# Altium project CanStepDriverPowerstep.PrjPcb
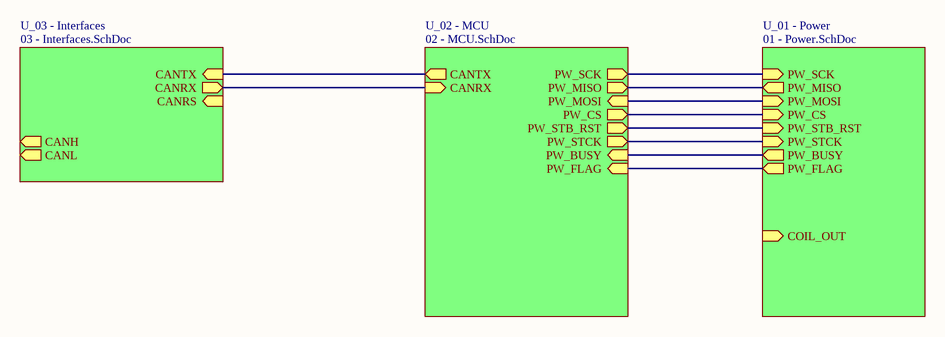
[diagram p0: 00 - Structure.SchDoc]
4 sheets, 45 parts. Net scope: hierarchical (ports join the sheet entries above them; power ports are global).
Board file: CanStepDriverPowerstep.PcbDoc
Sheets:
  00 - Structure.SchDoc
    U_01 - Power = 01 - Power.SchDoc
    U_02 - MCU = 02 - MCU.SchDoc
    U_03 - Interfaces = 03 - Interfaces.SchDoc

## Sheet 00 - Structure.SchDoc
size A4

### Sub-sheets
U_01 - Power = 01 - Power.SchDoc: COIL_OUT (in), PW_CS (in), PW_SCK (in), PW_MISO (out), PW_MOSI (in), PW_STB_RST (in), PW_BUSY (out), PW_FLAG (out), PW_STCK (in)
U_02 - MCU = 02 - MCU.SchDoc: CANTX (out), CANRX (in), PW_SCK (out), PW_MISO (out), PW_MOSI (in), PW_CS (out), PW_STB_RST (out), PW_STCK (out), PW_BUSY (in), PW_FLAG (in)
U_03 - Interfaces = 03 - Interfaces.SchDoc: CANH (out), CANL (out), CANTX (in), CANRX (out), CANRS (in)

### Nets
PA0: sheet U_01 - Power/PW_FLAG, sheet U_02 - MCU/PW_FLAG
PA1: sheet U_01 - Power/PW_BUSY, sheet U_02 - MCU/PW_BUSY
PA2: sheet U_01 - Power/PW_STCK, sheet U_02 - MCU/PW_STCK
PA3: sheet U_01 - Power/PW_STB_RST, sheet U_02 - MCU/PW_STB_RST
PA4: sheet U_01 - Power/PW_CS, sheet U_02 - MCU/PW_CS
PA5: sheet U_01 - Power/PW_SCK, sheet U_02 - MCU/PW_SCK
PA6: sheet U_01 - Power/PW_MISO, sheet U_02 - MCU/PW_MISO
PA7: sheet U_01 - Power/PW_MOSI, sheet U_02 - MCU/PW_MOSI
NetU4_33: sheet U_02 - MCU/CANRX, sheet U_03 - Interfaces/CANRX
NetU4_34: sheet U_02 - MCU/CANTX, sheet U_03 - Interfaces/CANTX

## Sheet 01 - Power.SchDoc
size A4; SheetNumber: 1; SheetTotal: 4
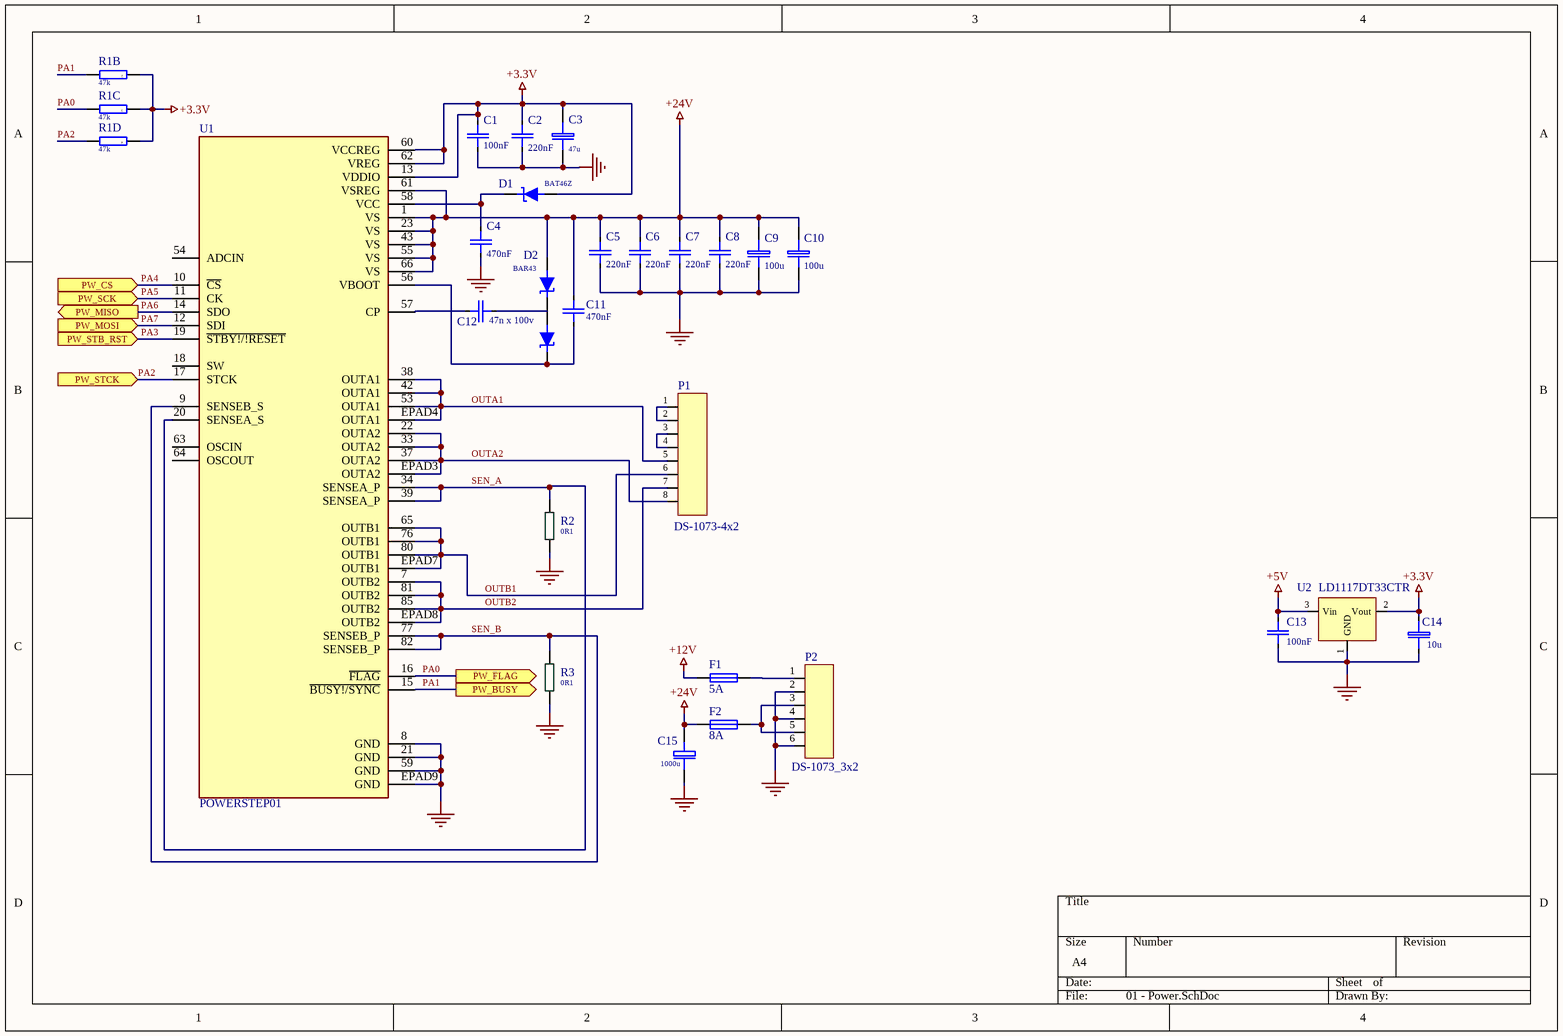
[diagram p1: 01 - Power.SchDoc]

### Parts
C1  100nF  [CAP: 0805]
C2  220nF  [CAP: 0805]
C3  47u  [EL SMD Case C D5x5.3 h5.4(0505)]
C4  470nF  [CAP: 0805]
C5  220nF  [CAP: 0805]
C6  220nF  [CAP: 0805]
C7  220nF  [CAP: 0805]
C8  220nF  [CAP: 0805]
C9  100u  [EL SMD Case G D10x10.3 h10.2(1010)]
C10  100u  [EL SMD Case G D10x10.3 h10.2(1010)]
C11  470nF  [CAP: 0805]
C12  value 47n x 100v  [CAP: 0805]
C13  100nF  [CAP: 0805]
C14  10u  [EL Case A (3216-18)]
C15  1000u  [El-d13-h21-F5.08]
D1  BAT46Z  [SOD123]
D2  BAR43  [SOT23]
F1  5A  [Littelfuse 0451/453]
F2  8A  [Littelfuse 0451/453]
P1  DS-1073-4x2  [DS-1073-4x2]
P2  DS-1073_3x2  [DS-1073-2x3]
R1  47k  [RM4x0603]  (parts B,C,D of 4)
R2  0R1  [R2512]
R3  0R1  [R2512]
U1  POWERSTEP01  [POWERSTEP01]
U2  LD1117DT33CTR  [DPAK]

### Ports
PW_BUSY (out), PW_CS (in), PW_FLAG (out), PW_MISO (out), PW_MOSI (in), PW_SCK (in), PW_STB_RST (in), PW_STCK (in)

### Nets
+3.3V: C1.2 C2.1 C3.1(+) C14.1 D1.1(A) R1.2 R1.3 R1.4 U1.13(VDDIO) U1.60(VCCREG) U1.62(VREG) U2.2(Vout)
+5V: C13.2 U2.3(Vin)
+12V: F1.1
+24V: C5.1 C6.1 C7.1 C8.1 C9.1 C10.1 C11.1 C15.1 D2.1 F2.1 U1.1(VS) U1.23(VS) U1.43(VS) U1.55(VS) U1.61(VSREG) U1.66(VS)
GND: C1.1 C2.2 C3.2(-) C4.2 C5.2 C6.2 C7.2 C8.2 C9.2 C10.2 C13.1 C14.2 C15.2 P2.2 P2.4 P2.6 R2.1 R3.1 U1.8(GND) U1.21(GND) U1.59(GND) U1.EPAD9(GND) U2.1(GND)
OUTA1: P1.5 U1.38(OUTA1) U1.42(OUTA1) U1.53(OUTA1) U1.EPAD4(OUTA1)
OUTA2: P1.8 U1.22(OUTA2) U1.33(OUTA2) U1.37(OUTA2) U1.EPAD3(OUTA2)
OUTB1: P1.6 U1.65(OUTB1) U1.76(OUTB1) U1.80(OUTB1) U1.EPAD7(OUTB1)
OUTB2: P1.7 U1.7(OUTB2) U1.81(OUTB2) U1.85(OUTB2) U1.EPAD8(OUTB2)
PA0: R1.6 U1.16(~{FLAG}) ; port PW_FLAG
PA1: R1.7 U1.15(~{BUSY!/SYNC}) ; port PW_BUSY
PA2: R1.5 U1.17(STCK) ; port PW_STCK
PA3: U1.19(~{STBY!/!RESET}) ; port PW_STB_RST
PA4: U1.10(~{CS}) ; port PW_CS
PA5: U1.11(CK) ; port PW_SCK
PA6: U1.14(SDO) ; port PW_MISO
PA7: U1.12(SDI) ; port PW_MOSI
SEN_A: R2.2 U1.20(SENSEA_S) U1.34(SENSEA_P) U1.39(SENSEA_P)
SEN_B: R3.2 U1.9(SENSEB_S) U1.77(SENSEB_P) U1.82(SENSEB_P)
NetC4_1: C4.1 D1.2(C) U1.58(VCC)
NetC11_2: C11.2 D2.2 U1.56(VBOOT)
NetC12_1: C12.1 U1.57(CP)
NetC12_2: C12.2 D2.3
NetF1_2: F1.2 P2.1
NetF2_2: F2.2 P2.3 P2.5
NetP1_1: P1.1 P1.2
NetP1_3: P1.3 P1.4

Not connected (* = marked no-connect by the designer): U1 18(SW) 54(ADCIN) 63(OSCIN) 64(OSCOUT)

### Library data of the parts
C1 C2 C4-C8 C11-C13 = C-0805: SMD-0805; Price: 0.014
  C1 C13: Value: 100nF
  C2 C5-C8: Value: 220nF; ComponentLink1Description: New link; ComponentLink1URL: https://www.electronshik.ru/item/YAG/CC0805KKX7R9BB224
  C4 C11: Value: 470nF; ComponentLink1Description: New link; ComponentLink1URL: https://www.electronshik.ru/item/MUR/GRM21BR71H474KA88L
  C12: ComponentLink1Description: New link; ComponentLink1URL: https://www.electronshik.ru/item/YAG/CC0805KKX7R0BB473
C3 = EL 10u/50V: EL 50V SMD Case C D5x5.3 h5.4; Price: 0.014; Value: 47u
C9 C10 = EL 100u/35V: EL 35V SMD Case G D10x10.3h10.5; Price: 0.014; Value: 100u; ComponentLink1Description: New link; ComponentLink1URL: https://www.chipdip.ru/product0/9000565738
C14 = EL 10u/16V Tant.: El Case A (2012-12); Price: 0.22; Value: 10u; ComponentLink1Description: New link; ComponentLink1URL: https://www.electronshik.ru/item/VISHAY/293D106X0016A2TE3; ComponentLink2Description: New link; ComponentLink2URL: https://www.chipdip.ru/product0/868717967
C15 = 1000u-35V 105F: 35V 105C 34m 1.8A 5000h; Price: 0.42; Value: 1000u
D1 = 1N6263: SMD-SOT123 60V 15mA 2.2pF 1nS; Price: 0.07; ComponentLink1Description: New link; ComponentLink1URL: https://www.electronshik.ru/item/ST/BAT46ZFILM
D2 = BAT54S: SMD-SOT23 30V 0.2A 5nS 10pF; Price: 0.08; ComponentLink1Description: New link; ComponentLink1URL: https://www.electronshik.ru/item/ST/BAR43FILM
F1 F2 = Littelfuse 0451: 0451003; Price: 0.3; ComponentLink1Description: New link; ComponentLink1URL: https://www.electronshik.ru/item/LTL/0451003.MRL
R1 = 4RM-0603: SMD 4RM-0603 1\16W 5%; Price: 0.07; Value: 47k; ComponentLink1Description: New link; ComponentLink1URL: https://www.electronshik.ru/item/BOURNS/CAT16-473J4LF
R2 R3 = R-2512: SMD 2512 1W 5% 200V; Price: 0.087; Value: 0R1; ComponentLink1Description: New link; ComponentLink1URL: https://www.electronshik.ru/item/BOURNS/CRA2512-FZ-R100ELF
U1 = POWERSTEP01: Bipolar Motor Driver Power MOSFET SPI 89-VFQFPN _11x14_; MF: STMicroelectronics; MP: POWERSTEP01; Availability: Unavailable; Package: PowerVFQFN-89 STMicroelectronics; Value: *; Price: None; ComponentLink1Description: Buy; ComponentLink1URL: https://www.electronshik.ru/item/ST/POWERSTEP01; ComponentLink2Description: Module; ComponentLink2URL: https://www.st.com/resource/en/user_manual/dm00206777-getting-started-with-the-high-power-stepper-motor-driver-expansion-board-based-on-powerstep01-for-stm32-nucleo-stmicroelectronics.pdf; ComponentLink3Description: Software; ComponentLink3URL: https://www.st.com/resource/en/user_manual/dm00207127-getting-started-with-the-xcubespn3-high-power-stepper-motor-driver-software-expansion-for-stm32cube-stmicroelectronics.pdf; ComponentLink4Description: Datasheet; ComponentLink4URL: https://www.st.com/resource/en/datasheet/powerstep01.pdf
P1 = DS-1073-4x2: ComponentLink1Description: New link; ComponentLink1URL: https://www.chipdip.ru/product/ds1073-01-2x4-mr2t6-mf2x4mra
P2 = DS-1073_3x2: ComponentLink1Description: New link; ComponentLink1URL: https://www.chipdip.ru/product/ds1073-01-2x3-mr2t6-mf2x3mra
U2 = LD1117DT33CTR: ComponentLink1Description: New link; ComponentLink1URL: https://www.chipdip.ru/product/ld1117dt33ctr

## Sheet 02 - MCU.SchDoc
size A4; SheetNumber: 2; SheetTotal: 4
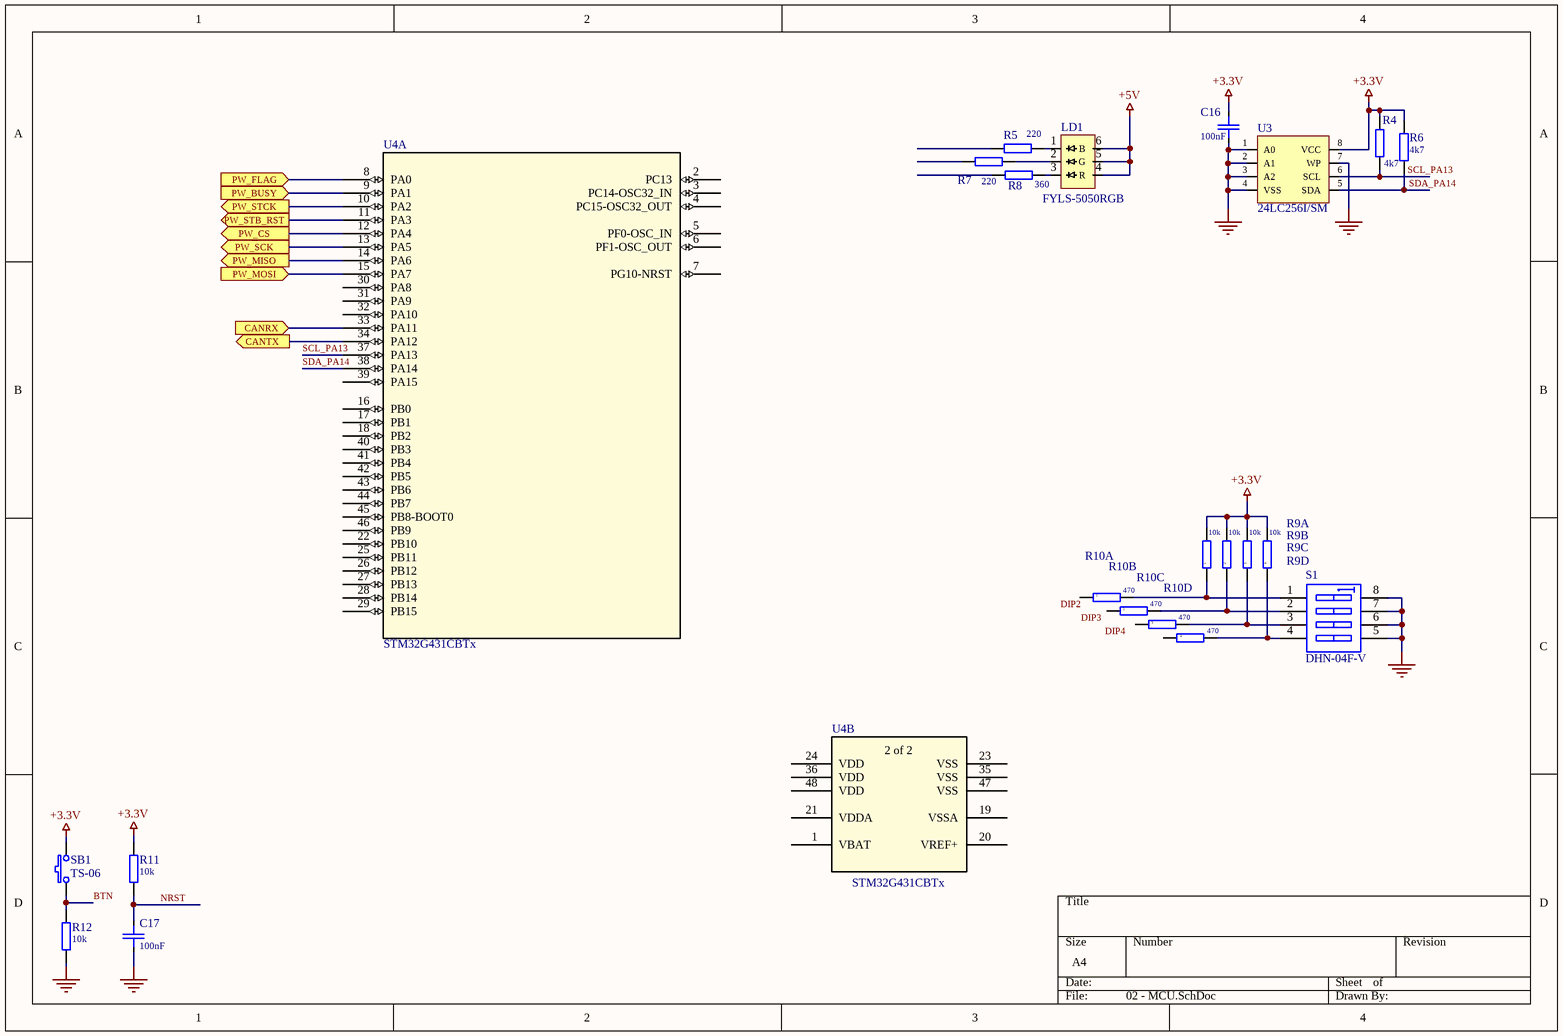
[diagram p2: 02 - MCU.SchDoc]

### Parts
C16  100nF  [CAP: 0805]
C17  100nF  [CAP: 0805]
LD1  FYLS-5050RGB  [FYLS-5050RGB]
R4  4k7  [RES: 0603]
R5  220  [RES: 0603]
R6  4k7  [RES: 0603]
R7  220  [RES: 0603]
R8  360  [RES: 0603]
R9  10k  [RM4x0603]  (parts A,B,C,D of 4)
R10  470  [RM4x0603]  (parts A,B,C,D of 4)
R11  10k  [RES: 0603]
R12  10k  [RES: 0603]
S1  DHN-04F-V  [SOIC-8-DIP_W]
SB1  TS-06  [TS-06]
U3  24LC256I/SM  [SOP-8N (SOIJ)]
U4  STM32G431CBTx  [LQFP48-7x7mm]  (parts A,B of 2)

### Ports
CANRX (in), CANTX (out), PW_BUSY (in), PW_CS (out), PW_FLAG (in), PW_MISO (out), PW_MOSI (in), PW_SCK (out), PW_STB_RST (out), PW_STCK (out)

### Nets
+3.3V: C16.1 R4.2 R6.2 R9.5 R9.6 R9.7 R9.8 R11.1 SB1.2 U3.8(VCC)
+5V: LD1.4(R) LD1.5(G) LD1.6(B)
GND: C16.2 C17.2 R12.2 S1.5(B4) S1.6(B3) S1.7(B2) S1.8(B1) U3.1(A0) U3.2(A1) U3.3(A2) U3.4(VSS) U3.7(WP)
BTN: R12.1 SB1.1
NRST: C17.1 R11.2
PA0: U4.8(PA0) ; port PW_FLAG
PA1: U4.9(PA1) ; port PW_BUSY
PA2: U4.10(PA2) ; port PW_STCK
PA3: U4.11(PA3) ; port PW_STB_RST
PA4: U4.12(PA4) ; port PW_CS
PA5: U4.13(PA5) ; port PW_SCK
PA6: U4.14(PA6) ; port PW_MISO
PA7: U4.15(PA7) ; port PW_MOSI
SCL_PA13: R4.1 U3.6(SCL) U4.37(PA13)
SDA_PA14: R6.1 U3.5(SDA) U4.38(PA14)
NetLD1_1: LD1.1 R5.2
NetLD1_2: LD1.2 R7.2
NetLD1_3: LD1.3 R8.2
NetR9_1: R9.1 R10.8 S1.1(A1)
NetR9_2: R9.2 R10.7 S1.2(A2)
NetR9_3: R9.3 R10.6 S1.3(A3)
NetR9_4: R9.4 R10.5 S1.4(A4)
NetU4_33: U4.33(PA11) ; port CANRX
NetU4_34: U4.34(PA12) ; port CANTX

Not connected (* = marked no-connect by the designer): R5 1; R7 1; R8 1; R10 1 2 3 4; U4 1(VBAT) 2(PC13) 3(PC14-OSC32_IN) 4(PC15-OSC32_OUT) 5(PF0-OSC_IN) 6(PF1-OSC_OUT) 7(PG10-NRST) 16(PB0) 17(PB1) 18(PB2) 19(VSSA) 20(VREF+) 21(VDDA) 22(PB10) 23(VSS) 24(VDD) 25(PB11) 26(PB12) 27(PB13) 28(PB14) 29(PB15) 30(PA8) 31(PA9) 32(PA10) 35(VSS) 36(VDD) 39(PA15) 40(PB3) 41(PB4) 42(PB5) 43(PB6) 44(PB7) 45(PB8-BOOT0) 46(PB9) 47(VSS) 48(VDD)

### Notes on the sheet
- Labels drawn without touching a wire or pin: DIP2, DIP3, DIP4
- (in symbol STM32G431CBTx, part B) 2 of 2

### Library data of the parts
C16 C17 = C-0805: SMD-0805; Price: 0.014; Value: 100nF
R4-R8 R11 R12 = R-0603: SMD 0603 0.0625W 5% 50V; Price: 0.017
  R4 R6: Value: 4k7
  R5 R7: Value: 220
  R8: Value: 360
  R11 R12: Value: 10k
R9 R10 = 4RM-0603: SMD 4RM-0603 1\16W 5%; Price: 0.07; ComponentLink1Description: New link
  R9: Value: 10k; ComponentLink1URL: https://www.electronshik.ru/item/BOURNS/CAT16-103J4LF
  R10: Value: 470; ComponentLink1URL: https://www.electronshik.ru/item/BOURNS/CAT16-471J4LF
S1 = SW DIP-4: DIP Switch, 4 Position, SPST; Published: 24-Mar-1999; LatestRevisionDate: 29-May-2009; LatestRevisionNote: IPC-7351 Footprint Added.; PackageVersion: Dec-2002; PackageReference: SO8; Publisher: Altium Limited; PackageDescription: 8-Pin Small Outline Integrated Circuit 1.27 mm Pitch; Code_JEDEC: MS-012-AA; Code_IPC: SOIC127P600-8; ComponentLink1Description: New link; ComponentLink1URL: https://www.electronshik.ru/item/DIP/DHN-04F-V
SB1 = Buton TS-06: Price: 0.15
U4 = STM32G431CBTx: Mainstream Arm Cortex-M4 core with DSP and FPU, 170MHz with 128Kbytes of Flash memory, Math Accelerator, Medium Analog level integration; Manufacturer_Part_Number: stm32g4_lqfp48_t1; Built_By: EMA_Jessica; Vendor: STMicroelectronics; Copyright: Copyright (C) 2016 Accelerated Designs. All rights reserved; RefDes: RefDes; Type: DEV; Value: Value
LD1 = FYLS-5050RGB: ComponentLink1Description: New link; ComponentLink1URL: https://www.chipdip.ru/catalog/smd-leds?gq=FYLS-5050RGB
U3 = 24LC256I/SM: ComponentLink1Description: New link; ComponentLink1URL: https://www.chipdip.ru/product/24lc256-i-sm

## Sheet 03 - Interfaces.SchDoc: Ethernet connections
size A4; SheetNumber: 3; SheetTotal: 4
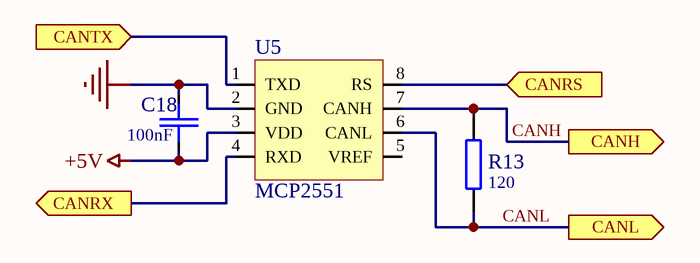
[diagram p3: 03 - Interfaces.SchDoc]

### Parts
C18  100nF  [CAP: 0805]
R13  120  [RES: 0805]
U5  MCP2551  [SOIC-8N]

### Ports
CANH (out), CANL (out), CANRS (in), CANRX (out), CANTX (in)

### Nets
+5V: C18.1 U5.3(VDD)
GND: C18.2 U5.2(GND)
CANH: R13.2 U5.7(CANH) ; port CANH
CANL: R13.1 U5.6(CANL) ; port CANL
NetU4_33: U5.4(RXD) ; port CANRX
NetU4_34: U5.1(TXD) ; port CANTX
NetU5_8: U5.8(RS) ; port CANRS

Not connected (* = marked no-connect by the designer): U5 5(VREF)

### Library data of the parts
C18 = C-0805: SMD-0805; Price: 0.014; Value: 100nF
R13 = R-0805: SMD 0805 0.1W 5% 150V; Price: 0.017; Value: 120

## Nets that join several sheets
+3.3V: 01 - Power (12 pins), 02 - MCU (10 pins)
+5V: 01 - Power (C13.2 U2.3), 02 - MCU (LD1.4 LD1.5 LD1.6), 03 - Interfaces (C18.1 U5.3)
GND: 01 - Power (23 pins), 02 - MCU (12 pins), 03 - Interfaces (C18.2 U5.2)
NetU4_33: 02 - MCU (U4.33), 03 - Interfaces (U5.4)
NetU4_34: 02 - MCU (U4.34), 03 - Interfaces (U5.1)
PA0: 01 - Power (R1.6 U1.16), 02 - MCU (U4.8)
PA1: 01 - Power (R1.7 U1.15), 02 - MCU (U4.9)
PA2: 01 - Power (R1.5 U1.17), 02 - MCU (U4.10)
PA3: 01 - Power (U1.19), 02 - MCU (U4.11)
PA4: 01 - Power (U1.10), 02 - MCU (U4.12)
PA5: 01 - Power (U1.11), 02 - MCU (U4.13)
PA6: 01 - Power (U1.14), 02 - MCU (U4.14)
PA7: 01 - Power (U1.12), 02 - MCU (U4.15)